# EAGLE schematic AlcoTop (EAGLE 6.3)
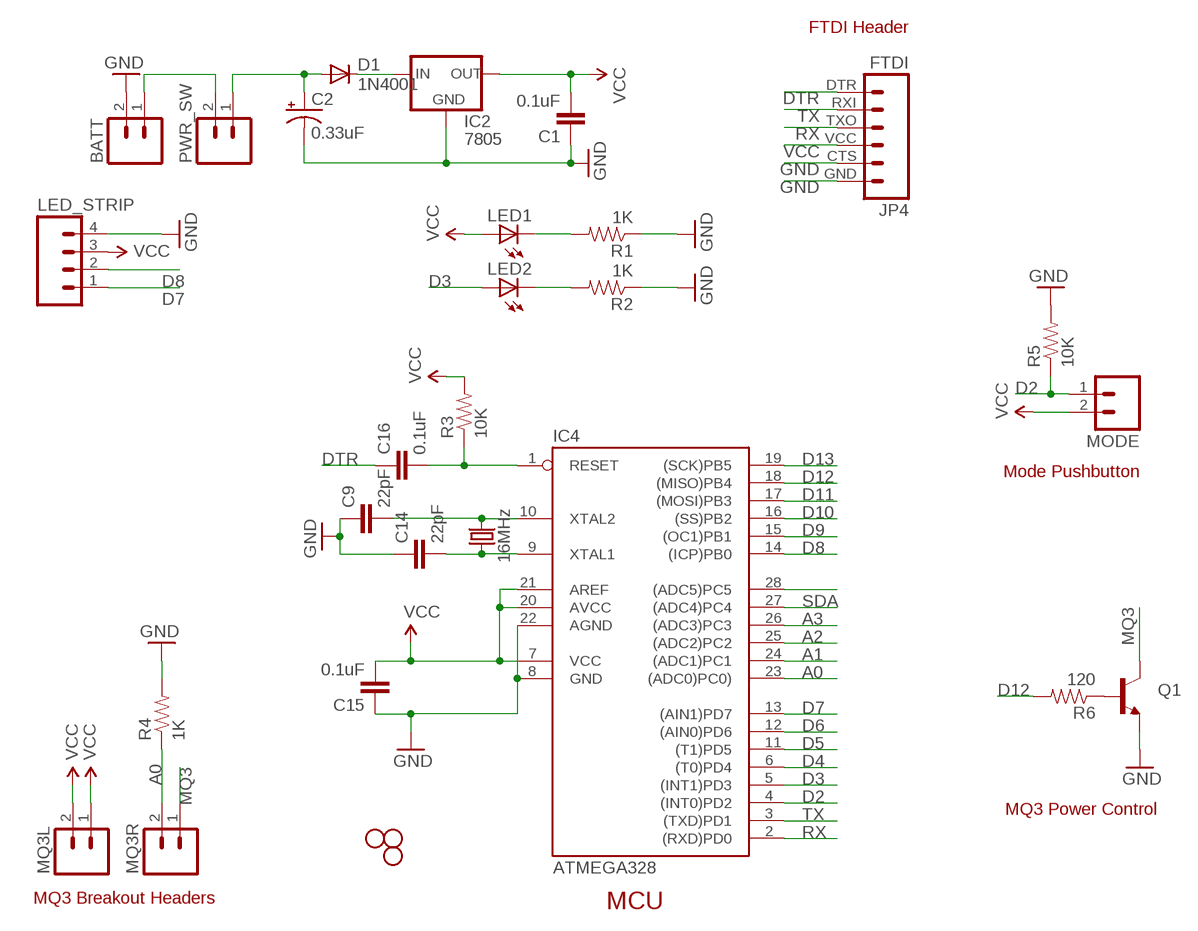
[diagram p0: schematic, sheet 1]

## Parts
BATT  M02LOCK_LONGPADS  [1X02_LOCK_LONGPADS]
C1  0.1uF  CAPPTH2  [CAP-PTH-SMALL2]
C2  0.33uF  CAP_POLPTH2  [CPOL-RADIAL-10UF-25V]
C9  22pF  CAPPTH2  [CAP-PTH-SMALL2]
C14  22pF  CAPPTH2  [CAP-PTH-SMALL2]
C15  0.1uF  CAPPTH2  [CAP-PTH-SMALL2]
C16  0.1uF  CAPPTH2  [CAP-PTH-SMALL2]
D1  1N4001  DIODEPTH  [DIODE-1N4001]
IC2  7805  V_REG_78XXSINK  [TO220-IGO]
IC4  ATMEGA328  AT90S4433P  [DIL28-3]
JP1  STAND-OFF#2  [STAND-OFF-#2]
JP2  STAND-OFF#2  [STAND-OFF-#2]
JP4  FTDI  FTDI_BASICPTH  [FTDI_BASIC]
JP6  STAND-OFF#2  [STAND-OFF-#2]
LED1  LED5MM  [LED5MM]
LED2  LED5MM  [LED5MM]
LED_STRIP  M04LOCK_LONGPADS  [1X04_LOCK_LONGPADS]
MODE  M02LOCK_LONGPADS  [1X02_LOCK_LONGPADS]
MQ3L  M02LOCK_LONGPADS  [1X02_LOCK_LONGPADS]
MQ3R  M02LOCK_LONGPADS  [1X02_LOCK_LONGPADS]
PWR_SW  M02LOCK_LONGPADS  [1X02_LOCK_LONGPADS]
Q1  TRANSISTOR_NPNTO-92-AMMO  [TO-92-AMMO]
R1  1K  RESISTORAXIAL-0.3  [AXIAL-0.3]
R2  1K  RESISTORAXIAL-0.3  [AXIAL-0.3]
R3  10K  RESISTORAXIAL-0.3  [AXIAL-0.3]
R4  1K  RESISTORAXIAL-0.3  [AXIAL-0.3]
R5  10K  RESISTORAXIAL-0.3  [AXIAL-0.3]
R6  120  RESISTORAXIAL-0.3  [AXIAL-0.3]
Y1  16MHz  CRYSTALHC49US  [HC49US]

## Nets
A0: IC4.23((ADC0)PC0)) MQ3R.2 R4.P$1
A1: IC4.24((ADC1)PC1)
A2: IC4.25((ADC2)PC2)
A3: IC4.26((ADC3)PC3)
D2: IC4.4((INT0)PD2) MODE.1 R5.P$1
D3: IC4.5((INT1)PD3) LED2.A
D4: IC4.6((T0)PD4)
D5: IC4.11((T1)PD5)
D6: IC4.12((AIN0)PD6)
D7: IC4.13((AIN1)PD7) LED_STRIP.1
D8: IC4.14((ICP)PB0) LED_STRIP.2
D9: IC4.15((OC1)PB1)
D10: IC4.16((SS)PB2)
D11: IC4.17((MOSI)PB3)
D12: IC4.18((MISO)PB4) R6.P$2
D13: IC4.19((SCK)PB5)
DTR: C16.1 JP4.DTR
GND [power]: BATT.2 C1.1 C2.2(-) C9.1 C14.1 C15.1 IC2.GND IC4.8(GND) IC4.22(AGND) JP4.CTS JP4.GND LED_STRIP.4 Q1.1(E) R1.P$1 R2.P$1 R4.P$2 R5.P$2
MQ3 [power]: MQ3R.1 Q1.3(C)
N$1: LED1.K(C) R1.P$2
N$2: BATT.1 PWR_SW.2
N$3 [power]: C2.1(+) D1.A PWR_SW.1
N$4: LED2.K(C) R2.P$2
N$5: IC4.28((ADC5)PC5)
N$6 [power]: D1.C IC2.IN
N$7: Q1.2(B) R6.P$1
RST: C16.2 IC4.1(RESET) R3.P$1
RX: IC4.2((RXD)PD0) JP4.TXO
SDA: IC4.27((ADC4)PC4)
TX: IC4.3((TXD)PD1) JP4.RXI
VCC [power]: C1.2 C15.2 IC2.OUT IC4.7(VCC) IC4.20(AVCC) IC4.21(AREF) JP4.VCC LED1.A LED_STRIP.3 MODE.2 MQ3L.1 MQ3L.2 R3.P$2
XTAL1: C14.2 IC4.9(XTAL1) Y1.1
XTAL2: C9.2 IC4.10(XTAL2) Y1.2

## Notes on the sheet
- FTDI Header
- Mode Pushbutton
- MQ3 Power Control
- MQ3 Breakout Headers
- MCU

## Library data of the parts
BATT MODE MQ3L MQ3R PWR_SW = Dek:M02: Header 2 Standard 2-pin 0.1" header. Use with straight break away headers (SKU : PRT-00116), right angle break away headers (PRT-00553), swiss pins (PRT-00743), machine pins (PRT-00117), and female headers (PRT-00115). Molex polarized connector foot print use with SKU : PRT-08233 with associated crimp pins and housings.
C1 C9 C14-C16 = Dek:CAP: Capacitor Standard 0603 ceramic capacitor, and 0.1" leaded capacitor.
C2 = Dek:CAP_POL: Capacitor Polarized These are standard SMD and PTH capacitors. Normally 10uF, 47uF, and 100uF in electrolytic and tantalum varieties. Always verify the external diameter of the through hole cap, it varies with capacity, voltage, and manufacturer. The EIA devices should be standard.
D1 = Dek:DIODE: Diode These are standard reverse protection diodes and small signal diodes. SMA package can handle up to about 1A. SOD-323 can handle about 200mA. What the SOD-323 package when ordering, there are some mfgs out there that are 5-pin packages.
IC2 = Dek:V_REG_78XX: Voltage Regulator Standard 7805 5V regulator. IGO (Input Ground Output). Spark Fun Electronics SKU : COM-00107
IC4 = Dek:AT90S4433: MICROCONTROLLER 4 Kbytes FLASH 128 bytes SRAM 256 bytes EEPROM UART 6-channel 10 bit ADC; OC_FARNELL: unknown; OC_NEWARK: unknown
JP1 JP2 JP6 = Dek:STAND-OFF: Stand Off This is the mechanical footprint for a #2 phillips button head screw. Use the keepout ring to avoid running the screw head into surrounding components.
JP4 = Dek:FTDI_BASIC: FTDI Basic: 3.3V and 5V
LED1 LED2 = Dek:LED: LEDs Standard schematic elements and footprints for 5mm, 3mm, 1206, and 0603 sized LEDs. 5mm - Spark Fun Electronics SKU : COM-00529 (and others)
LED_STRIP = Dek:M04: Header 4 Standard 4-pin 0.1" header. Use with straight break away headers (SKU : PRT-00116), right angle break away headers (PRT-00553), swiss pins (PRT-00743), machine pins (PRT-00117), and female headers (PRT-00115). Molex polarized connector foot print use with SKU : PRT-08231 with associated crimp pins and housings. 1MM SMD Version SKU: PRT-10208
Q1 = SparkFun-DiscreteSemi:TRANSISTOR_NPN: Generic NPN BJT. MMBT2222 is the common NPN we use. Double check against datasheet- not all devices are the same!
R1-R6 = Dek:RESISTOR: Resistor Basic schematic elements and footprints for 0603, 1206, and PTH resistors.
Y1 = Dek:CRYSTAL: Various standard crystals. Proven footprints. Spark Fun Electronics SKU : COM-00534

## Net classes
2 old_power: width 0.813 mm, clearance 0.508 mm